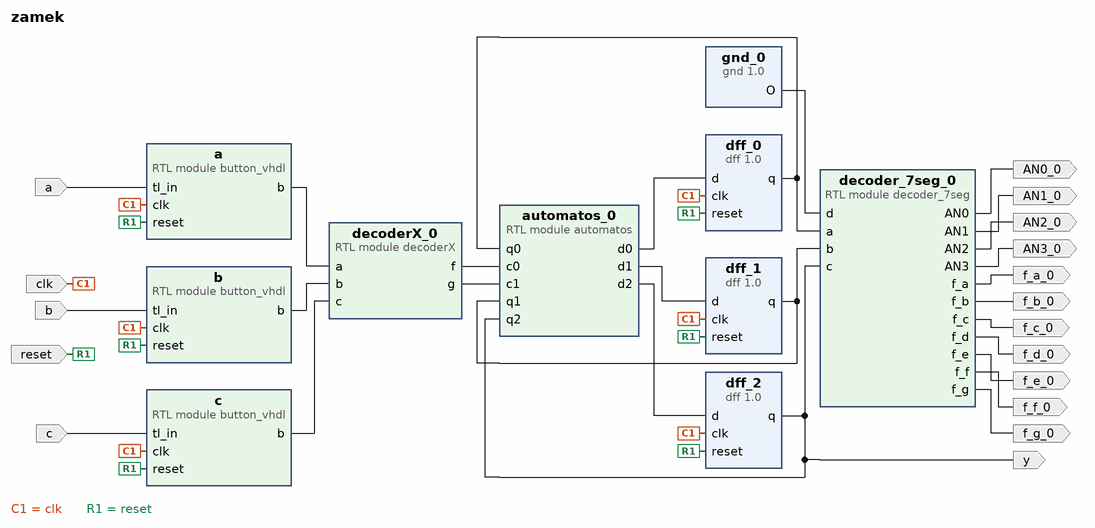
[diagram p0: block diagram of the top level]
# Vivado block design zamek, xc7a35tcpg236-1, Vivado 2018.2.1
create_bd_design zamek

create_bd_port -dir O y
create_bd_port -dir I c
create_bd_port -dir I a
create_bd_port -dir I b
create_bd_port -dir I clk
create_bd_port -dir I reset
create_bd_port -dir O AN0_0
create_bd_port -dir O AN1_0
create_bd_port -dir O AN2_0
create_bd_port -dir O AN3_0
create_bd_port -dir O f_a_0
create_bd_port -dir O f_b_0
create_bd_port -dir O f_c_0
create_bd_port -dir O f_d_0
create_bd_port -dir O f_e_0
create_bd_port -dir O f_f_0
create_bd_port -dir O f_g_0

create_bd_cell -type ip -vlnv FIT:user:dff:1.0 dff_0
create_bd_cell -type ip -vlnv FIT:user:dff:1.0 dff_1
create_bd_cell -type ip -vlnv FIT:user:dff:1.0 dff_2
create_bd_cell -type ip -vlnv FIT:user:gnd:1.0 gnd_0
create_bd_cell -type module -reference decoderX decoderX_0
create_bd_cell -type module -reference decoder_7seg decoder_7seg_0
create_bd_cell -type module -reference button_vhdl b
create_bd_cell -type module -reference button_vhdl a
create_bd_cell -type module -reference button_vhdl c
create_bd_cell -type module -reference automatos automatos_0

# ---- connections ----

connect_bd_net [get_bd_pins dff_0/q] [get_bd_pins decoder_7seg_0/a] [get_bd_pins automatos_0/q0]
connect_bd_net [get_bd_pins dff_1/q] [get_bd_pins decoder_7seg_0/b] [get_bd_pins automatos_0/q1]
connect_bd_net [get_bd_pins dff_2/q] [get_bd_ports y] [get_bd_pins decoder_7seg_0/c] [get_bd_pins automatos_0/q2]
connect_bd_net [get_bd_ports c] [get_bd_pins c/tl_in]
connect_bd_net [get_bd_ports a] [get_bd_pins a/tl_in]
connect_bd_net [get_bd_ports b] [get_bd_pins b/tl_in]
connect_bd_net [get_bd_ports clk] \
  [get_bd_pins dff_0/clk] [get_bd_pins dff_1/clk] [get_bd_pins dff_2/clk] [get_bd_pins b/clk] [get_bd_pins a/clk] \
  [get_bd_pins c/clk]
connect_bd_net [get_bd_ports reset] \
  [get_bd_pins dff_0/reset] [get_bd_pins dff_1/reset] [get_bd_pins dff_2/reset] [get_bd_pins b/reset] [get_bd_pins a/reset] \
  [get_bd_pins c/reset]
connect_bd_net [get_bd_pins gnd_0/O] [get_bd_pins decoder_7seg_0/d]
connect_bd_net [get_bd_pins decoder_7seg_0/AN0] [get_bd_ports AN0_0]
connect_bd_net [get_bd_pins decoder_7seg_0/AN1] [get_bd_ports AN1_0]
connect_bd_net [get_bd_pins decoder_7seg_0/AN2] [get_bd_ports AN2_0]
connect_bd_net [get_bd_pins decoder_7seg_0/AN3] [get_bd_ports AN3_0]
connect_bd_net [get_bd_pins decoder_7seg_0/f_a] [get_bd_ports f_a_0]
connect_bd_net [get_bd_pins decoder_7seg_0/f_b] [get_bd_ports f_b_0]
connect_bd_net [get_bd_pins decoder_7seg_0/f_c] [get_bd_ports f_c_0]
connect_bd_net [get_bd_pins decoder_7seg_0/f_d] [get_bd_ports f_d_0]
connect_bd_net [get_bd_pins decoder_7seg_0/f_e] [get_bd_ports f_e_0]
connect_bd_net [get_bd_pins decoder_7seg_0/f_f] [get_bd_ports f_f_0]
connect_bd_net [get_bd_pins decoder_7seg_0/f_g] [get_bd_ports f_g_0]
connect_bd_net [get_bd_pins b/b] [get_bd_pins decoderX_0/b]
connect_bd_net [get_bd_pins c/b] [get_bd_pins decoderX_0/c]
connect_bd_net [get_bd_pins a/b] [get_bd_pins decoderX_0/a]
connect_bd_net [get_bd_pins decoderX_0/f] [get_bd_pins automatos_0/c0]
connect_bd_net [get_bd_pins decoderX_0/g] [get_bd_pins automatos_0/c1]
connect_bd_net [get_bd_pins automatos_0/d0] [get_bd_pins dff_0/d]
connect_bd_net [get_bd_pins automatos_0/d1] [get_bd_pins dff_1/d]
connect_bd_net [get_bd_pins automatos_0/d2] [get_bd_pins dff_2/d]

validate_bd_design
save_bd_design
